# EAGLE design thg (EAGLE 9.3.0)
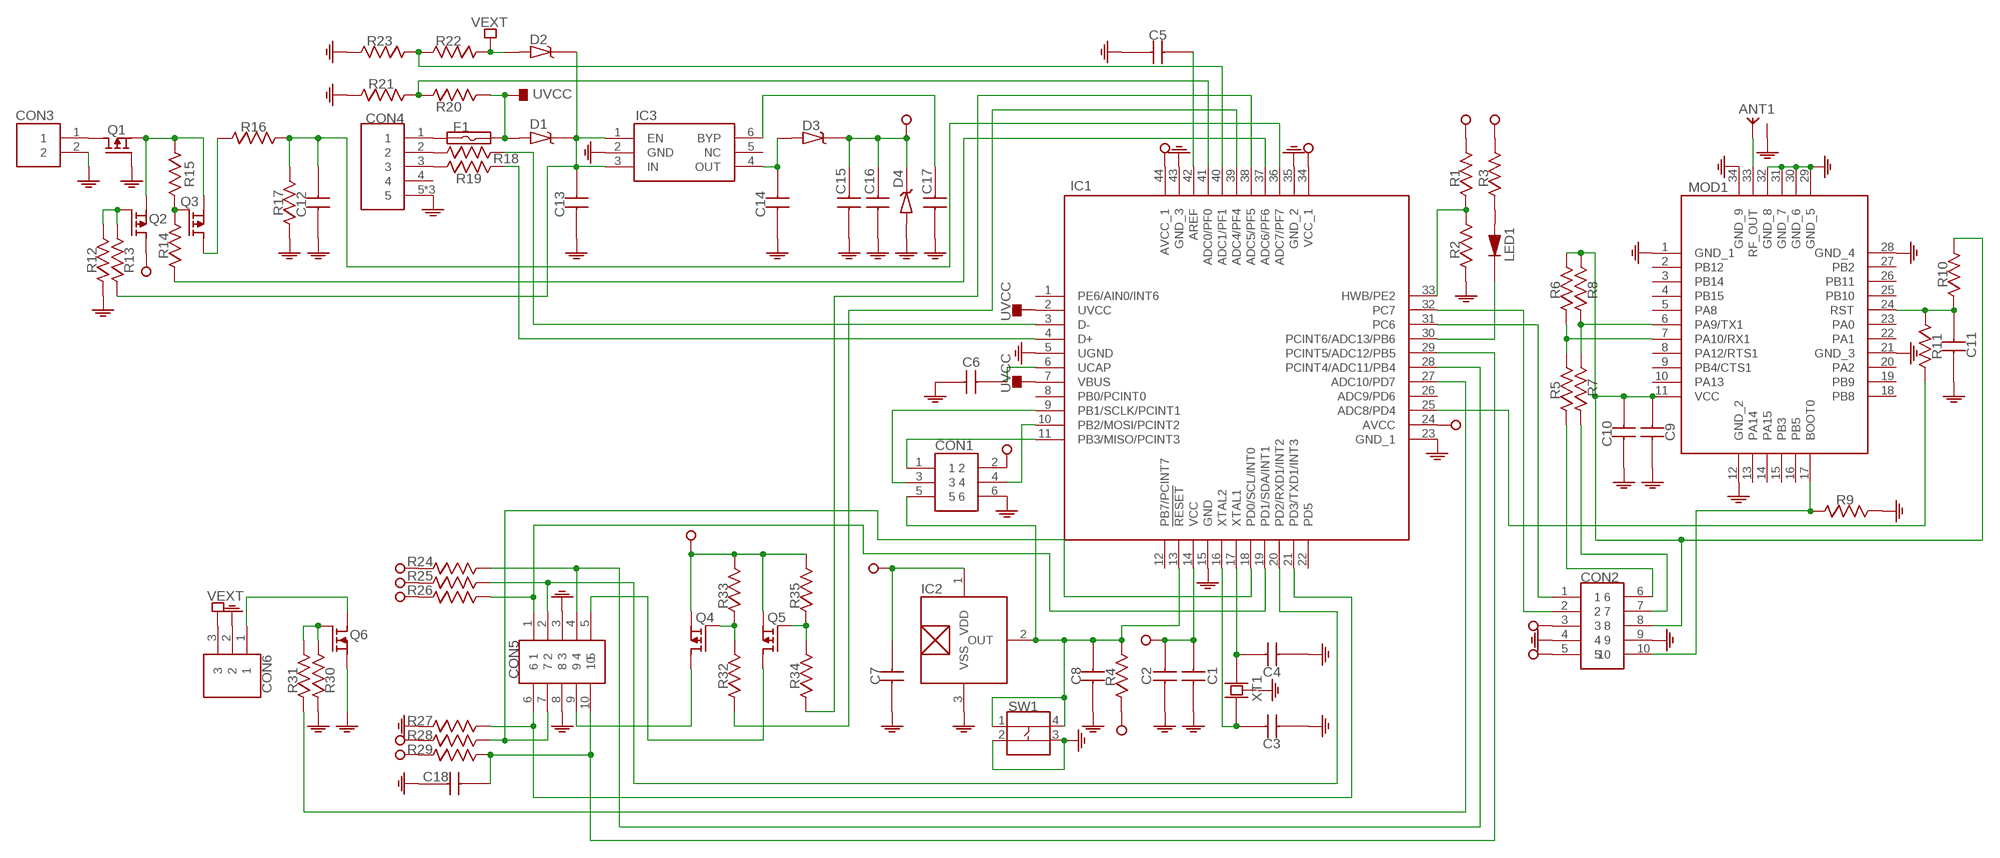
[diagram p0: schematic, sheet 1]

## Parts
ANT1  SMA-RF  [SMA-RF]
C1  CAPACITOR-0603  [0603]
C2  CAPACITOR-0603  [0603]
C3  CAPACITOR-0603  [0603]
C4  CAPACITOR-0603  [0603]
C5  CAPACITOR-0603  [0603]
C6  CAPACITOR-0603  [0603]
C7  CAPACITOR-0603  [0603]
C8  CAPACITOR-0603  [0603]
C9  CAPACITOR-0603  [0603]
C10  CAPACITOR-0603  [0603]
C11  CAPACITOR-0603  [0603]
C12  CAPACITOR-0603  [0603]
C13  CAPACITOR-0805  [0805]
C14  CAPACITOR-0805  [0805]
C15  CAPACITOR-0603  [0603]
C16  CAPACITOR-0603  [0603]
C17  CAPACITOR-0603  [0603]
C18  CAPACITOR-0603  [0603]
CON1  ISP  [ISP]
CON2  HEADER-10P-2R-DIP-2_54MM  [HEADER-10P-2R-DIP-2_54MM]
CON3  JST-PH-2-2.0MM  [JST-PH-2-2.0MM]
CON4  USB-MICRO-DIP-VER  [USB-MICRO-DIP-VER]
CON5  HEADER-10P-2R-DIP-2_54MM  [HEADER-10P-2R-DIP-2_54MM]
CON6  CON-3_50MM-3P-1985205  [CON-3_50MM-3P-1985205]
D1  DIODE-SCHOTTKY  [SOD123-DIODE]
D2  DIODE-SCHOTTKY  [SOD123-DIODE]
D3  DIODE-SCHOTTKY  [SOD123-DIODE]
D4  ZENER-SOD123  [SOD123-DIODE]
F1  FUSE-0805  [0805]
IC1  ATMEGA32U4-MU  [QFN-44]
IC2  S-5712-SOT23-3  [SOT23-3]
IC3  MIC5219-VDFN-6  [VDFN-6]
LED1  LED-0603  [LED-0603]
MOD1  RAK811  [RAK811]
Q1  P-MOSFET  [SOT23-3]
Q2  P-MOSFET  [SOT23-3]
Q3  P-MOSFET  [SOT23-3]
Q4  P-MOSFET  [SOT23-3]
Q5  P-MOSFET  [SOT23-3]
Q6  N-MOSFET  [SOT23-3]
R1  RESISTOR-0603  [0603]
R2  RESISTOR-0603  [0603]
R3  RESISTOR-0603  [0603]
R4  RESISTOR-0603  [0603]
R5  RESISTOR-0603  [0603]
R6  RESISTOR-0603  [0603]
R7  RESISTOR-0603  [0603]
R8  RESISTOR-0603  [0603]
R9  RESISTOR-0603  [0603]
R10  RESISTOR-0603  [0603]
R11  RESISTOR-0603  [0603]
R12  RESISTOR-0603  [0603]
R13  RESISTOR-0603  [0603]
R14  RESISTOR-0603  [0603]
R15  RESISTOR-0603  [0603]
R16  RESISTOR-0603  [0603]
R17  RESISTOR-0603  [0603]
R18  RESISTOR-0603  [0603]
R19  RESISTOR-0603  [0603]
R20  RESISTOR-0603  [0603]
R21  RESISTOR-0603  [0603]
R22  RESISTOR-0603  [0603]
R23  RESISTOR-0603  [0603]
R24  RESISTOR-0603  [0603]
R25  RESISTOR-0603  [0603]
R26  RESISTOR-0603  [0603]
R27  RESISTOR-0603  [0603]
R28  RESISTOR-0603  [0603]
R29  RESISTOR-0603  [0603]
R30  RESISTOR-0603  [0603]
R31  RESISTOR-0603  [0603]
R32  RESISTOR-0603  [0603]
R33  RESISTOR-0603  [0603]
R34  RESISTOR-0603  [0603]
R35  RESISTOR-0603  [0603]
SW1  BUTTON-4P-SMD-5X5  [BUTTON-4P-SMD-5X5]
XT1  CRYSTAL-5032-4P  [CRYSTAL-5032-4P]

## Nets
GND: ANT1.2(GND) ANT1.3(GND) ANT1.4(GND) ANT1.5(GND) C1.1 C2.1 C3.1 C4.1 C5.1 C6.1 C7.1 C8.1 C9.1 C10.1 C11.1 C12.1 C13.1 C14.1 C15.1 C16.1 C17.1 C18.1 CON1.6 CON2.4 CON2.9 CON3.2 CON4.5 CON4.6 CON4.7 CON5.3 CON5.8 CON6.2 D4.2(A) IC1.5(UGND) IC1.15(GND) IC1.23(GND_1) IC1.35(GND_2) IC1.43(GND_3) IC2.3(VSS) IC3.2(GND) MOD1.1(GND_1) MOD1.12(GND_2) MOD1.21(GND_3) MOD1.28(GND_4) MOD1.29(GND_5) MOD1.30(GND_6) MOD1.31(GND_7) MOD1.32(GND_8) MOD1.34(GND_9) Q1.1(G) Q6.2(S) R2.1 R9.2 R12.1 R17.1 R21.1 R23.2 R27.1 R30.1 SW1.2 SW1.3
N$1: CON5.1 IC1.19(PD1/SDA/INT1) R26.2
N$2: C11.2 MOD1.24(RST) R10.1 R11.1
N$3: CON1.1 IC1.11(PB3/MISO/PCINT3)
N$4: ANT1.1(ANT) MOD1.33(RF_OUT)
N$5: CON5.9 Q4.3(D)
N$6: MOD1.7(PA10/RX1) R5.2 R6.1
N$7: MOD1.6(PA9/TX1) R7.2 R8.1
N$8: IC1.27(ADC10/PD7) R31.1
N$9: CON1.4 IC1.10(PB2/MOSI/PCINT2)
N$10: C3.2 IC1.16(XTAL2) XT1.1
N$11: CON5.5 Q5.3(D)
N$12: C4.2 IC1.17(XTAL1) XT1.3
N$13: C9.2 C10.2 CON2.8 MOD1.11(VCC) R6.2 R8.2 R10.2
N$14: CON2.7 R7.1
N$15: Q6.1(G) R30.2 R31.2
N$16: IC1.25(ADC8/PD4) R11.2
N$17: CON5.4 IC1.28(PCINT4/ADC11/PB4) R24.2
N$18: CON6.1 Q6.3(D)
N$19: IC1.30(PCINT6/ADC13/PB6) LED1.1(K)
N$20: C18.2 CON5.10 IC1.29(PCINT5/ADC12/PB5) R29.2
N$21: CON2.1 IC1.31(PC6)
N$22: CON5.7 IC1.18(PD0/SCL/INT0) R28.2
N$23: CON2.2 IC1.32(PC7)
N$24: CON5.2 IC1.20(PD2/RXD1/INT2) R25.2
N$25: CON5.6 IC1.21(PD3/TXD1/INT3) R27.2
N$28: Q5.1(G) R34.2 R35.1
N$31: C5.2 IC1.42(AREF)
N$32: Q3.1(G) R14.2 R15.2
N$33: CON4.1 F1.1
N$34: C6.2 IC1.6(UCAP)
N$35: LED1.2(A) R3.1
N$36: C12.2 IC1.36(ADC7/PF7) R16.2 R17.2
N$37: C17.2 IC3.6(BYP)
N$38: C13.2 D1.1(K) D2.1(K) IC3.1(EN) IC3.3(IN) R13.1
N$39: IC1.41(ADC0/PF0) R20.1 R21.2
N$40: C14.2 D3.2(A) IC3.4(OUT)
N$41: CON4.2 R18.1
N$42: CON4.3 R19.1
N$43: IC1.3(D-) R18.2
N$44: IC1.4(D+) R19.2
N$45: CON1.3 IC1.9(PB1/SCLK/PCINT1)
N$46: Q4.1(G) R32.2 R33.1
N$47: IC1.37(ADC6/PF6) R14.1
N$49: IC1.40(ADC1/PF1) R22.2 R23.1
N$50: IC1.38(ADC5/PF5) R34.1
N$51: IC1.39(ADC4/PF4) R32.1
N$53: Q2.1(G) R12.2 R13.2
N$55: CON3.1 Q1.3(D)
N$58: Q1.2(S) Q2.2(S) Q3.2(S) R15.1
N$59: Q3.3(D) R16.1
N$60: CON2.6 R5.1
N$61: IC1.33(HWB/PE2) R1.1 R2.2
N$63: CON2.10 MOD1.17(BOOT0) R9.1
N$64: C8.2 CON1.5 IC1.13(!RESET) IC2.2(OUT) R4.2 SW1.1 SW1.4
UVCC: D1.2(A) F1.2 IC1.2(UVCC) IC1.7(VBUS) R20.2
VCC: C1.2 C2.2 C7.2 C15.2 C16.2 CON1.2 CON2.3 CON2.5 D3.1(K) D4.1(K) IC1.14(VCC) IC1.24(AVCC) IC1.34(VCC_1) IC1.44(AVCC_1) IC2.1(VDD) Q2.3(D) Q4.2(S) Q5.2(S) R1.2 R3.2 R4.1 R24.1 R25.1 R26.1 R28.1 R29.1 R33.2 R35.2
VEXT: CON6.3 D2.2(A) R22.1
Unconnected: CON4.4 IC1.1(PE6/AIN0/INT6) IC1.8(PB0/PCINT0) IC1.12(PB7/PCINT7) IC1.22(PD5) IC1.26(ADC9/PD6) IC3.5(NC) MOD1.2(PB12) MOD1.3(PB14) MOD1.4(PB15) MOD1.5(PA8) MOD1.8(PA12/RTS1) MOD1.9(PB4/CTS1) MOD1.10(PA13) MOD1.13(PA14) MOD1.14(PA15) MOD1.15(PB3) MOD1.16(PB5) MOD1.18(PB8) MOD1.19(PB9) MOD1.20(PA2) MOD1.22(PA1) MOD1.23(PA0) MOD1.25(PB10) MOD1.26(PB11) MOD1.27(PB2)

## Power pins joined to a net without a drawn wire
GND: XT1.2(GND) XT1.4(GND)

## Library data of the parts
ANT1 = SamacSys_Parts:SMA-RF
C1-C12 C15-C18 = SamacSys_Parts:CAPACITOR-0603
C13 C14 = SamacSys_Parts:CAPACITOR-0805
CON1 = SamacSys_Parts:ISP
CON2 CON5 = SamacSys_Parts:HEADER-10P-2R-DIP-2_54MM
CON3 = SamacSys_Parts:JST-PH-2-2.0MM
CON4 = SamacSys_Parts:USB-MICRO-DIP-VER
CON6 = SamacSys_Parts:CON-3_50MM-3P-1985205
D1-D3 = SamacSys_Parts:DIODE-SCHOTTKY
D4 = SamacSys_Parts:ZENER-SOD123
F1 = SamacSys_Parts:FUSE-0805
IC1 = SamacSys_Parts:ATMEGA32U4-MU
IC2 = SamacSys_Parts:S-5712-SOT23-3
IC3 = SamacSys_Parts:MIC5219-VDFN-6
LED1 = SamacSys_Parts:LED-0603
MOD1 = SamacSys_Parts:RAK811
Q1-Q5 = SamacSys_Parts:P-MOSFET
Q6 = SamacSys_Parts:N-MOSFET
R1-R35 = SamacSys_Parts:RESISTOR-0603
SW1 = SamacSys_Parts:BUTTON-4P-SMD-5X5
XT1 = SamacSys_Parts:CRYSTAL-5032-4P

## Board
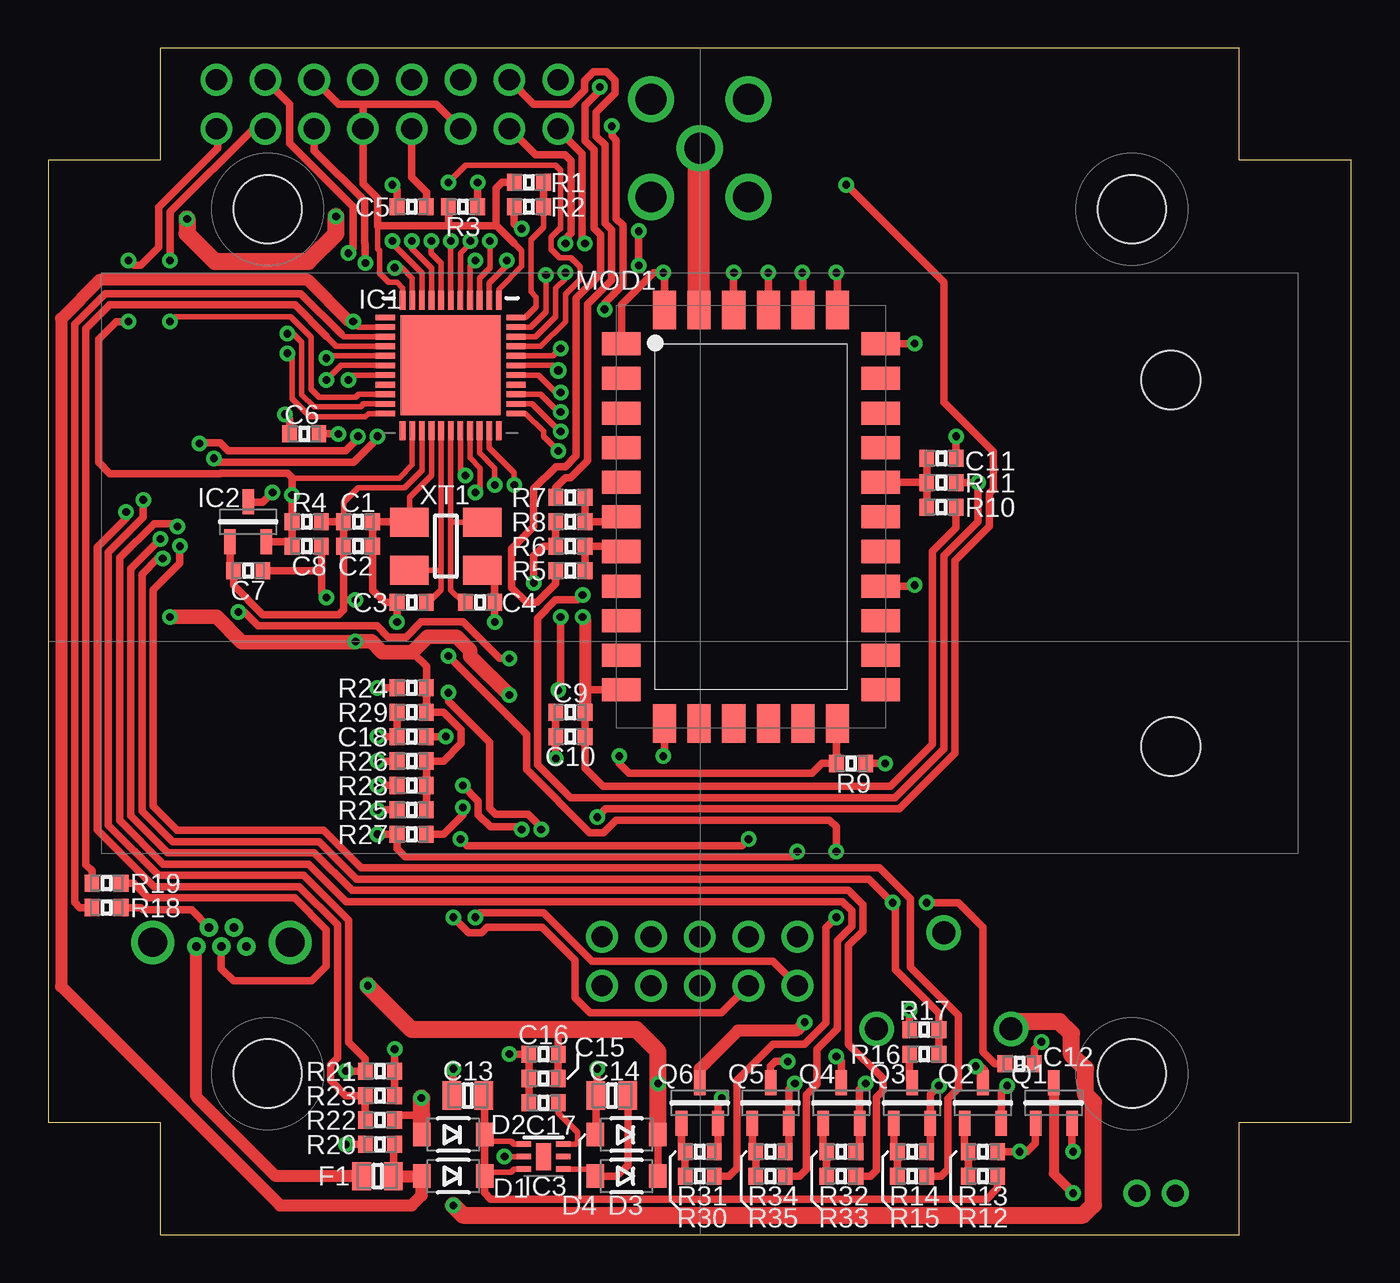
[diagram p1: board, top side]
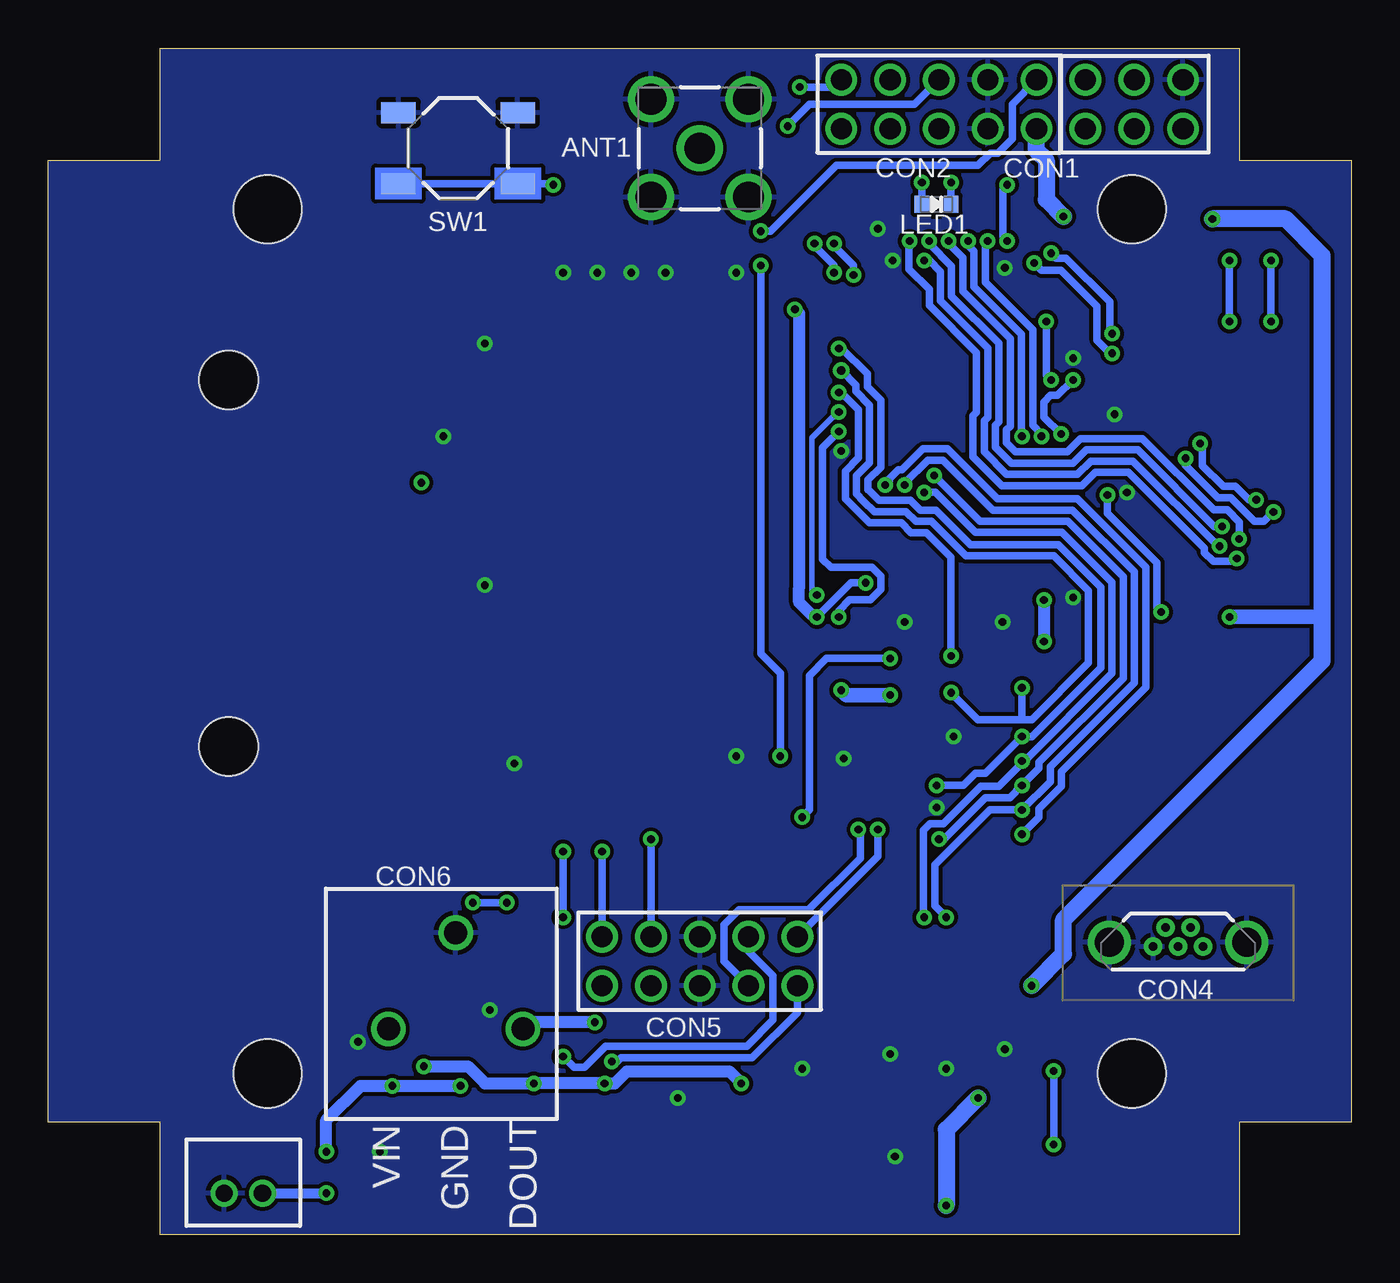
[diagram p2: board, bottom side, seen from below]

Size 67.82 x 61.72 mm. Coordinates in mm from the lower left corner, seen from the top.
Outline: 0,5.84 5.84,5.84 5.84,0 61.98,0 61.98,5.84 67.82,5.84 67.82,55.88 61.98,55.88 61.98,61.72 5.84,61.72 5.84,55.88 0,55.88 0,5.84
Copper layers (1*16): Top 0.035mm / dielectric 1.5mm / Bottom 0.035mm
Design rules "qfn": minimum track width 10mil, minimum drill 0.4mm, track to track 8mil, track to pad 10mil, pad to pad 8mil, via to via 8mil, smd to smd 0mil, copper to edge 0mil, drill to drill 6mil, minimum pad ring 10mil, minimum via ring 8mil, stop-mask expansion 4mil, vias tented up to drill 25mil, thermal gap 10mil
Holes 3.56 mm at 11.43,8.38 56.39,8.38 56.39,53.34 11.43,53.34
Holes 3.05 mm at 58.42,44.45 58.42,25.4
bRestrict: area 21.3,52.8 to 21.8,55

### Footprints (pad centres in the part's own frame; a part is rotated, then mirrored left to right if it is on the bottom)
SMA-RF = drill 1.6: 1 0,0; 2 -2.54,2.54; 3 -2.54,-2.54; 4 2.54,-2.54; 5 2.54,2.54
0603 = smd 0.762 x 0.889: 1 -0.762,0; 2 0.762,0
0805 = smd 0.97 x 1.47: 1 -0.83,0; 2 0.83,0
ISP = drill 1.1 pad 1.65: 1 0,0; 2 2.54,0; 3 0,-2.54; 4 2.54,-2.54; 5 0,-5.08; 6 2.54,-5.08
HEADER-10P-2R-DIP-2_54MM = drill 1.1 pad 1.65: 1 0,0; 2 2.54,0; 3 5.08,0; 4 7.62,0; 5 10.16,0; 6 0,2.54; 7 2.54,2.54; 8 5.08,2.54; 9 7.62,2.54; 10 10.16,2.54
JST-PH-2-2.0MM = drill 0.9: 1 -1,0; 2 1,0
USB-MICRO-DIP-VER = drill 0.45: 1 -1.3,0; 2 -0.65,-1; 3 0,0; 4 0.65,-1; 5 1.3,0 | drill 1.5: 6 -3.575,-0.22; 7 3.575,-0.22
CON-3_50MM-3P-1985205 = drill 1.2: 1 3.5,-2.5; 2 0,2.5; 3 -3.5,-2.5
SOD123-DIODE = smd 0.91 x 1.22: 1 -1.635,0; 2 1.635,0
QFN-44 = smd 1 x 0.3: 1 -3.4,2.5; 2 -3.4,2; 3 -3.4,1.5; 4 -3.4,1; 5 -3.4,0.5; 6 -3.4,0; 7 -3.4,-0.5; 8 -3.4,-1; 9 -3.4,-1.5; 10 -3.4,-2; 11 -3.4,-2.5; 23 3.4,-2.5; 24 3.4,-2; 25 3.4,-1.5; 26 3.4,-1; 27 3.4,-0.5; 28 3.4,0; 29 3.4,0.5; 30 3.4,1; 31 3.4,1.5; 32 3.4,2; 33 3.4,2.5 | smd 0.3 x 1: 12 -2.5,-3.4; 13 -2,-3.4; 14 -1.5,-3.4; 15 -1,-3.4; 16 -0.5,-3.4; 17 0,-3.4; 18 0.5,-3.4; 19 1,-3.4; 20 1.5,-3.4; 21 2,-3.4; 22 2.5,-3.4; 34 2.5,3.4; 35 2,3.4; 36 1.5,3.4; 37 1,3.4; 38 0.5,3.4; 39 0,3.4; 40 -0.5,3.4; 41 -1,3.4; 42 -1.5,3.4; 43 -2,3.4; 44 -2.5,3.4 | smd 5.2 x 5.2: 45 0,0
SOT23-3 = smd 1.3 x 0.6: 1 -1.05,0.95; 2 -1.05,-0.95; 3 1.05,0
VDFN-6 = smd 0.75 x 0.3: 1 -1.025,0.65; 2 -1.025,0; 3 -1.025,-0.65; 4 1.025,-0.65; 5 1.025,0; 6 1.025,0.65 | smd 0.8 x 1.4: 7 0,0
LED-0603 = smd 0.762 x 0.889: 1 -0.762,0; 2 0.762,0
RAK811 = smd 2 x 1.2: 1 -6.75,9; 2 -6.75,7.2; 3 -6.75,5.4; 4 -6.75,3.6; 5 -6.75,1.8; 6 -6.75,0; 7 -6.75,-1.8; 8 -6.75,-3.6; 9 -6.75,-5.4; 10 -6.75,-7.2; 11 -6.75,-9; 18 6.75,-9; 19 6.75,-7.2; 20 6.75,-5.4; 21 6.75,-3.6; 22 6.75,-1.8; 23 6.75,0; 24 6.75,1.8; 25 6.75,3.6; 26 6.75,5.4; 27 6.75,7.2; 28 6.75,9 | smd 1.2 x 2: 12 -4.5,-10.75; 13 -2.7,-10.75; 14 -0.9,-10.75; 15 0.9,-10.75; 16 2.7,-10.75; 17 4.5,-10.75; 29 4.5,10.75; 30 2.7,10.75; 31 0.9,10.75; 32 -0.9,10.75; 33 -2.7,10.75; 34 -4.5,10.75
BUTTON-4P-SMD-5X5 = smd 1.8 x 1.1: 1 -3.1,1.85; 2 -3.1,-1.85; 3 3.1,-1.85; 4 3.1,1.85
CRYSTAL-5032-4P = smd 2 x 1.5: 1 -1.9,-1.25; 2 1.9,-1.25; 3 1.9,1.25; 4 -1.9,1.25

### Placement (x,y rotation side)
ANT1  33.91,56.52 0 bottom
C1  16.13,37.08 180 top
C2  16.13,35.81 180 top
C3  18.92,32.89 0 top
C4  22.48,32.89 180 top
C5  18.92,53.47 180 top
C6  13.34,41.66 0 top
C7  10.41,34.54 180 top
C8  13.46,35.81 180 top
C9  27.18,27.18 0 top
C10  27.18,25.91 0 top
C11  46.48,40.39 180 top
C12  50.55,8.89 180 top
C13  21.84,7.24 0 top
C14  29.34,7.24 0 top
C15  25.78,8.13 0 top
C16  25.78,9.4 0 top
C17  25.78,6.86 0 top
C18  18.92,25.91 180 top
CON1  13.84,57.53 90 bottom
CON2  26.54,57.53 0 bottom
CON3  57.66,2.16 180 bottom
CON4  9.02,14.99 180 bottom
CON5  38.99,12.95 0 bottom
CON6  46.61,13.21 0 bottom
D1  21.08,3.05 180 top
D2  21.08,5.21 180 top
D3  30.1,3.05 180 top
D4  30.1,5.21 180 top
F1  17.14,3.05 0 top
IC1  20.95,45.21 0 top
IC2  10.41,37.08 90 top
IC3  25.78,4.06 0 top
LED1  21.59,53.59 180 bottom
MOD1  36.58,37.34 0 top
Q1  52.32,6.86 90 top
Q2  48.64,6.86 90 top
Q3  44.96,6.86 90 top
Q4  41.27,6.86 90 top
Q5  37.59,6.86 90 top
Q6  33.91,6.86 90 top
R1  25.02,54.74 180 top
R2  25.02,53.47 0 top
R3  21.59,53.47 180 top
R4  13.46,37.08 180 top
R5  27.18,34.54 0 top
R6  27.18,35.81 180 top
R7  27.18,38.35 0 top
R8  27.18,37.08 180 top
R9  41.78,24.51 0 top
R10  46.48,37.85 0 top
R11  46.48,39.12 0 top
R12  48.64,4.32 180 top
R13  48.64,3.05 180 top
R14  44.96,3.05 180 top
R15  44.96,4.32 180 top
R16  45.59,9.4 0 top
R17  45.59,10.67 0 top
R18  3.05,17.02 180 top
R19  3.05,18.29 180 top
R20  17.27,4.7 0 top
R21  17.27,8.51 180 top
R22  17.27,5.97 180 top
R23  17.27,7.24 0 top
R24  18.92,28.45 180 top
R25  18.92,22.1 180 top
R26  18.92,24.64 180 top
R27  18.92,20.83 180 top
R28  18.92,23.37 180 top
R29  18.92,27.18 180 top
R30  33.91,4.32 180 top
R31  33.91,3.05 180 top
R32  41.27,3.05 180 top
R33  41.27,4.32 0 top
R34  37.59,3.05 180 top
R35  37.59,4.32 0 top
SW1  46.48,56.52 180 bottom
XT1  20.7,35.81 0 top

### Tracks (layer width: path | path; a pad name or v marks a point on that pad's centre or on a via)
GND  (via drill 0.4)
  Top 0.292: IC3.2 v23.75,4.06 | IC1.15 19.95,39.51 18.8,38.36 XT1.4 18.8,37.08 | IC1.5 14.6,45.71 v14.48,45.59 | IC1.35 22.95,49.5 23.88,50.42 v23.88,50.67 | IC1.23 24.85,42.71 25.78,41.78 25.78,41.53 v26.54,40.77 | IC1.43 18.95,49.75 18.41,50.29 v18.03,50.29
  Top 0.381: R23.2 R21.1 v18.03,9.65 | D4.2 28.51,5.25 C14.1 28.57,7.31 v28.57,8.64 | C17.1 C15.1 C16.1 v24,9.4 | C13.1 21.08,7.31 v21.08,8.64 | R12.1 v50.55,4.32 50.93,4.32 51.37,4.76 Q1.1 | XT1.2 23.1,35.06 23.24,34.92 C4.1 v23.24,31.88 | 18.8,37.08 C1.1 C2.1 16.89,33.53 17.53,32.89 C3.1 v18.16,31.88 | C8.1 14.22,34.54 | 14.22,34.54 14.22,33.4 v14.48,33.15 | MOD1.34 32.08,49.97 v32,50.04 31.5,50.04 29.83,48.37 MOD1.1 | MOD1.32 35.68,50.03 v35.69,50.04 | MOD1.31 37.48,50.03 v37.47,50.04 | MOD1.30 39.28,50.01 v39.24,50.04 | MOD1.29 41.08,49.98 v41.02,50.04 | MOD1.28 45.07,46.34 v45.09,46.35 | MOD1.21 45.04,33.74 v45.09,33.78 | MOD1.12 32.08,24.96 v32,24.89 | v11.68,38.61 11.18,38.1 10.45,38.1 IC2.3 | C11.1 v47.24,41.53 | C9.1 C10.1 v26.42,24.77 | R9.2 v43.56,24.51 | C5.1 19.68,54.23 18.92,54.99 CON2.4 | R2.1 24.26,52.58 24.51,52.32 v24.64,52.32 | v51.69,10.03 51.31,9.65 C12.1 | v44.83,11.68 R17.1 | R30.1 34.86,4.51 Q6.2 34.86,6.92 v35.05,7.11 | C6.1 12.57,42.42 v12.32,42.67 | C7.1 14.22,34.54 | C18.1 v20.7,25.91 | v21.59,22.23 21.59,21.84 20.57,20.83 R27.1
  pour Bottom: 0.13,5.97 0.13,55.75 5.97,55.75 5.97,61.59 61.85,61.59 61.85,55.75 67.69,55.75 67.69,5.97 61.85,5.97 61.85,0.13 5.97,0.13 5.97,5.97
N$1  (via drill 0.4)
  Top 0.292: v22.23,38.61 22.48,38.86 22.48,39.88 21.95,40.4 IC1.19
  Top 0.381: CON5.1 37.72,14.22 28.3,14.22 25.79,16.74 22.45,16.74 v22.23,16.51 | R26.2 v17.14,24.64
  Bottom 0.381: v22.23,38.61 21.65,38.61 19.57,36.52 15.06,36.52 12.46,33.93 12.46,29.19 17.02,24.64 v17.14,24.64 17.14,24.51 18.34,23.32 19.29,23.32 21.24,21.37 21.92,21.37 22.26,21.03 22.26,16.55 v22.23,16.51
N$2
  Top 0.381: C11.2 R11.1 | R11.1 R10.1 | MOD1.24 45.7,39.14 R11.1
N$3  (via drill 0.4)
  Top 0.292: IC1.11 16.68,42.71 16.51,42.55 13.59,42.55 13.59,42.61 12.7,43.49 12.7,45.59 v12.45,45.85
  Top 0.381: CON1.1 13.84,56.39 16.46,53.77 16.46,51.6 16.51,51.55 v16.51,50.55
  Bottom 0.381: v12.45,45.85 12.57,45.85 13.24,46.52 13.24,48.3 15.11,50.16 16.13,50.16 v16.51,50.55
N$4
  Top 1.143: MOD1.33 33.88,56.48 ANT1.1
N$5  (via drill 0.4)
  Top 0.381: v41.02,9.27 41.27,9.02 Q4.3
  Bottom 0.381: v41.02,9.27 40.46,8.71 39.91,8.71 38.81,9.81 31.46,9.81 30.1,11.18 30.1,13.48 31.37,14.75 CON5.9
N$6
  Top 0.381: MOD1.7 29.55,35.81 R6.1 R5.2
N$7
  Top 0.381: MOD1.6 29.57,37.08 R8.1 R7.2
N$8  (via drill 0.4)
  Top 0.292: IC1.27 25.52,44.71 26.42,43.81 v26.67,43.81
  Top 0.381: R31.1 35.43,3.05 35.85,3.46 35.85,8.04 37.72,9.91 39.37,9.91 40.49,11.02 40.49,15.98 v41.02,16.51 | v20.83,30.1 24.89,26.04 24.89,24.21 28.18,20.92 28.91,20.92 29.55,21.57 40.66,21.57 41.02,21.21 v41.02,19.94
  Bottom 0.381: v41.02,16.51 v41.02,19.94 | v20.83,30.1 20.83,35.24 22.1,36.52 22.91,36.52 23.42,37.02 25.08,37.02 26.34,38.29 26.34,39.72 25.65,40.4 25.65,42.91 26.56,43.81 v26.67,43.81
N$9  (via drill 0.4)
  Top 0.292: v12.45,46.86 12.75,46.86 13.2,46.41 13.2,43.7 13.84,43.05 16.26,43.05 16.41,43.21 IC1.10
  Top 0.381: v15.62,51.05 15.88,51.31 15.88,53.47 12.57,56.77 12.57,58.8 CON1.4
  Bottom 0.381: v12.45,46.86 12.57,46.99 12.57,48.52 14.86,50.8 15.37,50.8 v15.62,51.05
N$10
  Top 0.292: IC1.16 20.45,34.56 | 20.45,34.56 20.45,33.54 19.81,32.89 C3.2 | XT1.1 20.45,34.56
N$11  (via drill 0.4)
  Top 0.381: Q5.3 37.59,8.76 37.85,9.02 v38.48,9.02
  Bottom 0.381: v38.48,9.02 38.18,9.02 37.99,9.2 31.18,9.2 28.83,11.56 CON5.5
N$12
  Top 0.292: C4.2 21.59,32.89 20.95,33.53 20.95,37.08 | IC1.17 20.95,37.08 | XT1.3 20.98,37.06 20.95,37.08
N$13  (via drill 0.4)
  Top 0.381: C9.2 C10.2 27.94,24.26 28.86,23.33 43.84,23.33 46.02,25.52 46.02,35.55 47.24,36.77 R10.2 | R8.2 R6.2 25.78,35.81 25.27,35.31 v25.27,33.91 | v28.96,48.13 28.96,48.45 29.91,49.4 29.91,52.5 29.57,52.84 29.57,56.92 29.34,57.15 v29.34,57.66 | MOD1.11 28.05,28.34 27.94,28.45
  Top 0.635: v27.81,32.13 27.94,32 27.94,28.45 C9.2
  Bottom 0.381: v27.81,32.13 27.81,32.15 26.05,33.91 v25.27,33.91 | v29.34,57.66 28.19,58.8 22.73,58.8 CON2.8
  Bottom 0.635: v27.81,32.13 27.91,32.22 28.07,32.22 28.74,32.89 28.74,33.66 28.73,33.67 28.73,47.9 v28.96,48.13
N$14
  Top 0.381: CON2.7 25.27,58.8 27.18,58.8 27.91,59.53 27.91,60.02 28.37,60.49 29.05,60.49 29.5,60.04 29.5,59.36 28.52,58.38 28.52,57.14 28.98,56.68 28.98,52.6 29.32,52.26 29.32,49.64 28.07,48.39 28.07,40.26 27.18,39.37 26.92,39.37 26.42,38.86 R7.1
N$15
  Top 0.381: Q6.1 32.96,4.51 R30.2 R31.2
N$16  (via drill 0.4)
  Top 0.292: IC1.25 25.63,43.71 26.54,42.8 v26.67,42.8
  Top 0.381: R11.2 v48.39,39.12 48.39,37.08 46.61,35.31 46.61,25.27 44.07,22.73 27.19,22.73 25.47,24.46 25.47,32.08 26.42,33.02 27.56,33.02 v27.81,33.27
  Bottom 0.292: v27.81,33.27 28.06,33.52 28.06,41.46 26.98,42.53 26.93,42.53 v26.67,42.8
N$17  (via drill 0.4, 0.45)
  Top 0.292: v26.54,44.96 26.29,45.21 IC1.28
  Top 0.381: R24.2 v17.14,28.45 | v20.83,28.19 20.83,27.75 22.97,25.61 22.97,22.19 23.28,21.88 24.97,21.88 25.65,21.19 v25.65,21.08
  Bottom 0.381: CON5.4 32.64,14.22 32.64,16.13 31.88,16.89 28.26,16.89 25.56,19.59 25.56,20.99 v25.65,21.08 | v20.83,28.19 19.43,26.8 17.14,26.8 | 17.14,26.8 16.64,26.8 13.68,29.75 13.68,33.49 15.49,35.31 20.07,35.31 21.86,37.1 22.67,37.1 23.18,37.61 24.83,37.61 25.38,38.16 25.39,38.16 25.76,38.53 25.76,39.47 25.07,40.16 25.07,43.15 25.78,43.86 25.78,44.2 v26.54,44.96 | v17.14,28.45 17.14,26.8
N$18  (via drill 0.4)
  Top 0.635: Q6.3 33.91,8.64 35.89,10.62 38.94,10.62 v39.37,11.05
  Bottom 0.635: v39.37,11.05 42.77,11.05 CON6.1
N$19  (via drill 0.4)
  Top 0.292: IC1.30 25.64,46.21 26.92,47.5 26.92,48.91 27.68,49.66 27.68,50.35 27.22,50.81 26.61,50.81 26.17,51.25 26.17,51.87 26.61,52.31 26.66,52.31 26.67,52.32 26.67,55.37 26.42,55.63 21.72,55.63 v20.83,54.74
  Bottom 0.381: LED1.1 v20.83,54.74
N$20  (via drill 0.4)
  Top 0.292: IC1.29 26.28,45.71 v26.67,46.1
  Top 0.381: R29.2 C18.2 v17.14,25.91 | v21.59,23.37 21.59,23.35 22.39,22.55 22.39,21.84 23.02,21.21 24.51,21.21 v24.64,21.08
  Bottom 0.381: CON5.10 24.64,19.68 v24.64,21.08 | v21.59,23.37 20.19,23.37 19.56,24 19.05,24 v17.14,25.91 16.64,25.91 13.05,29.5 13.05,33.68 15.25,35.89 19.82,35.89 21.62,37.68 22.43,37.68 22.94,38.19 24.59,38.19 25.14,38.74 25.15,38.74 25.15,39.26 24.49,39.92 24.49,43.39 25.2,44.1 25.2,44.77 26.52,46.1 v26.67,46.1
N$21  (via drill 0.4)
  Top 0.292: IC1.31 25.38,46.71 26.42,47.75 26.42,49.23 26.92,49.74 v26.92,50.04
  Top 0.381: v27.94,51.56 27.79,51.71 27.79,56.22 26.54,57.47 CON2.1
  Bottom 0.381: v26.92,50.04 26.92,50.42 27.94,51.44 v27.94,51.56
N$22  (via drill 0.4)
  Top 0.292: IC1.18 21.45,39.76 v21.72,39.5
  Top 0.381: v21.46,20.57 21.79,20.24 36.12,20.24 v36.45,20.57 | R28.2 v17.14,23.37
  Bottom 0.381: v21.72,39.5 19.33,37.11 14.76,37.11 11.88,34.23 11.88,28.95 16.26,24.57 16.26,24.26 v17.14,23.37 17.78,22.73 19.05,22.73 21.21,20.57 v21.46,20.57 | CON5.7 v36.45,20.57
N$23  (via drill 0.4)
  Top 0.292: IC1.32 25.11,47.21 25.91,48.01 v25.91,49.91
  Top 0.381: v26.92,51.56 27.05,51.69 27.05,51.94 27.21,52.1 27.21,55.85 26.89,56.17 25.37,56.17 CON2.2
  Bottom 0.381: v25.91,49.91 25.91,50.42 26.92,51.44 v26.92,51.56
N$24  (via drill 0.4)
  Top 0.292: v23.24,38.99 23.24,39.88 22.45,40.66 IC1.20
  Top 0.381: CON5.2 35.05,11.56 28.19,11.56 27.43,12.32 27.43,14.27 25.7,16 22.84,16 22.55,15.71 21.88,15.71 v21.08,16.51 | R25.2 v17.14,22.1
  Bottom 0.381: v23.24,38.99 23.24,39.1 22.05,40.29 21.26,40.29 18.66,37.69 14.51,37.69 11.29,34.47 11.29,28.71 15.67,24.33 15.67,23.57 v17.14,22.1 18.81,22.1 21.68,19.23 21.68,17.1 v21.08,16.51
N$25  (via drill 0.4)
  Top 0.292: IC1.21 22.95,40.93 24.26,39.62 v24.26,38.99
  Top 0.381: v38.99,19.94 38.71,19.66 18.57,19.66 18.16,20.07 R27.2 v17.14,20.83
  Bottom 0.381: v24.26,38.99 24.04,39.21 24.04,39.32 23.57,39.79 23.38,39.79 22.29,40.88 21.02,40.88 18.42,38.28 14.27,38.28 10.71,34.72 10.71,28.47 15.09,24.09 15.09,23.33 16.26,22.16 16.26,21.72 v17.14,20.83 | CON5.6 v38.99,19.94
N$28
  Top 0.381: Q5.1 36.64,4.51 R35.1 R34.2
N$31  (via drill 0.4)
  Top 0.292: IC1.42 19.45,50.01 17.91,51.56 v17.91,51.69
  Top 0.381: v17.91,54.61 18.16,54.36 C5.2
  Bottom 0.381: v17.91,51.69 18.13,51.91 18.13,54.39 v17.91,54.61
N$32
  Top 0.381: R14.2 R15.2 44.01,4.51 Q3.1
N$33
  Top 0.635: F1.1 11.85,3.05 7.72,7.18 CON4.1
N$34  (via drill 0.4)
  Top 0.292: IC1.6 15.24,45.21 v14.48,44.45
  Top 0.381: v15.11,41.66 C6.2
  Bottom 0.381: v15.11,41.66 15.13,41.66 16,42.53 16,43.31 15.66,43.65 15.29,43.65 14.49,44.45 v14.48,44.45
N$35  (via drill 0.4)
  Top 0.381: R3.1 v22.35,54.74
  Bottom 0.381: LED1.2 v22.35,54.74
N$36  (via drill 0.4)
  Top 0.292: IC1.36 22.45,49.76 22.99,50.29 v22.99,51.69
  Top 0.381: R16.2 R17.2 46.35,11.53 44.09,13.79 44.09,17.12 v43.94,17.27 42.72,18.49 16.05,18.49 14.1,20.45 6.48,20.45 4.89,22.04 4.89,34.35 5.71,35.18 v5.97,35.18 | C12.2 49.28,8.89 48.64,9.53 48.64,16 47.37,17.27 v45.72,17.27
  Bottom 0.381: v5.97,35.18 6.13,35.02 7.19,35.02 7.66,35.48 7.66,35.71 11.61,39.66 13.32,39.66 14.02,38.96 18.18,38.96 19.7,40.47 19.7,42.59 19.51,42.77 19.51,45.87 21.97,48.34 21.97,49.16 23.02,50.22 23.02,51.65 v22.99,51.69 | v45.72,17.27 v43.94,17.27
N$37
  Top 0.292: IC3.6 27.45,4.71 27.56,4.83 27.56,5.33 26.54,6.35 C17.2
N$38
  Top 0.292: D1.1 22.93,3.26 24.08,3.26 24.23,3.41 IC3.3 | IC3.1 24.23,4.71 24.08,4.87 23.06,4.87 D2.1
  Top 0.381: C13.2 22.72,7.2 D2.1 D1.1 22.72,2.17 23.04,1.85 27.3,1.85 48.84,1.85 49.4,2.41 R13.1
N$39  (via drill 0.4)
  Top 0.292: IC1.41 19.95,50.28 18.92,51.31 v18.92,51.69
  Top 0.381: R20.1 v15.49,4.7 | v15.49,8.51 R21.2 16.51,9.14 15.65,10.01 15.65,16.36 13.31,18.69 5.75,18.69 3.14,21.31 3.14,35.51 4.95,37.32 v4.95,38.23 | v16.13,41.53 16.13,41.42 15.48,40.77 9.38,40.77 8.97,41.18 7.91,41.18 v7.87,41.15
  Bottom 0.381: v15.49,8.51 v15.49,4.7 | v18.92,51.69 19.05,51.56 19.05,49.55 16.59,47.08 16.59,42.1 16.13,41.64 v16.13,41.53 | v7.87,41.15 7.75,41.02 7.75,40.01 6.68,38.94 6.04,38.94 5.33,38.23 v4.95,38.23
N$40
  Top 0.292: IC3.4 28.1,3.41 D3.2
  Top 0.381: D3.2 29.59,3.05 30.17,3.62 C14.2
N$41
  Top 0.381: R18.1 4.83,17.02 4.95,16.89 7.46,16.89 CON4.2
N$42
  Top 0.381: CON4.3 9.02,13.84 9.65,13.21 13.72,13.21 14.48,13.97 14.48,15.88 12.83,17.53 5.21,17.53 4.45,18.29 R19.1
N$43
  Top 0.292: IC1.3 15.39,46.71 15.24,46.86
  Top 0.381: 15.24,46.86 13.15,48.95 2.98,48.95 1.38,47.36 1.38,17.29 1.65,17.02 R18.2
N$44
  Top 0.292: IC1.4 15,46.21 14.48,46.74
  Top 0.381: 14.48,46.74 12.85,48.37 3.22,48.37 1.97,47.12 1.97,19.24 2.29,18.92 R19.2
N$45  (via drill 0.4)
  Top 0.292: IC1.9 16.15,43.71 16,43.56 14.1,43.56 13.69,43.96 13.69,46.68 12.62,47.75 6.6,47.75 v6.35,47.5
  Top 0.381: v6.35,50.67 6.35,53.2 10.69,57.53 CON1.3
  Bottom 0.381: v6.35,50.67 v6.35,47.5
N$46
  Top 0.381: Q4.1 40.33,4.51 R33.1 R32.2
N$47  (via drill 0.4)
  Top 0.292: IC1.37 21.95,50.4 v22.23,50.67
  Top 0.381: R14.1 46.47,3.05 46.82,3.4 46.82,7.08 47.37,7.63 47.37,11.4 44.87,13.91 44.87,17.48 43.27,19.07 16.3,19.07 14.34,21.03 6.72,21.03 5.47,22.28 5.47,33.54 6.86,34.92 v6.86,35.81
  Bottom 0.381: v6.86,35.81 6.94,35.81 11.37,40.24 13.56,40.24 14.26,39.55 17.94,39.55 19.11,40.72 19.11,42.34 18.92,42.53 18.92,46.11 21.39,48.58 21.39,50.09 21.97,50.67 v22.23,50.67
N$49  (via drill 0.4)
  Top 0.292: v19.94,51.69 19.94,51.05 20.45,50.54 IC1.40
  Top 0.381: R22.2 R23.1 15.49,7.24 14.7,8.04 14.7,8.84 15.06,9.2 15.06,16.12 13.07,18.11 5.51,18.11 2.55,21.07 2.55,35.75 4.06,37.26 v4.06,37.59 | v17.14,41.53 17.14,41.42 15.91,40.18 8.84,40.18 v8.64,40.39
  Bottom 0.381: v17.14,41.53 17.17,41.55 17.17,46.84 19.63,49.3 19.63,51.15 19.97,51.49 19.97,51.65 v19.94,51.69 | v8.64,40.39 8.64,40.02 6.95,38.34 6.29,38.34 5.06,37.11 4.55,37.11 v4.06,37.59
N$50  (via drill 0.4)
  Top 0.292: IC1.38 21.45,51.05 21.97,51.56 v21.97,51.69
  Top 0.381: R34.1 39.1,3.05 39.45,3.4 39.45,7.28 40.01,7.83 40.01,9.65 41.07,10.72 41.07,15.29 41.82,16.04 41.82,16.84 41.34,17.32 15.51,17.32 13.55,19.28 6,19.28 3.72,21.55 3.72,35.2 5.51,36.99 6.55,36.99 6.71,36.83 v6.73,36.83
  Bottom 0.381: v6.73,36.83 7.13,36.83 11.12,40.83 13.8,40.83 14.5,40.13 17.7,40.13 18.53,40.96 18.53,42.1 18.34,42.29 18.34,46.36 20.8,48.82 20.8,50.38 21.97,51.55 v21.97,51.69
N$51  (via drill 0.4)
  Top 0.292: IC1.39 v20.95,51.69
  Top 0.381: R32.1 42.78,3.05 43.1,3.36 43.1,7.16 43.43,7.49 43.43,8.13 41.66,9.91 41.66,15.05 42.4,15.79 42.4,17.16 41.66,17.91 15.81,17.91 13.86,19.86 6.24,19.86 4.3,21.8 4.3,34.64 5.84,36.18 v5.84,36.2
  Bottom 0.381: v5.84,36.2 5.84,37.07 6.47,37.7 7.17,37.7 10.88,41.41 14.1,41.41 14.78,40.73 17.48,40.73 17.94,41.2 17.94,41.86 17.75,42.05 17.75,46.6 20.22,49.06 20.22,50.83 20.83,51.44 20.83,51.56 v20.95,51.69
N$53
  Top 0.381: Q2.1 47.69,4.51 R12.2 R13.2
N$55  (via drill 0.4)
  Top 0.508: Q1.3 52.32,3.17 v53.34,2.16
  Bottom 0.508: CON3.1 v53.34,2.16
N$58  (via drill 0.4)
  Top 0.381: R15.1 45.91,4.51 Q3.2 45.91,7.3 v46.35,7.75 | Q2.2 49.59,7.43 v49.91,7.75 | v53.34,4.32 53.27,4.38 Q1.2
  Bottom 0.635: v46.35,7.75 v49.91,7.75 51.56,7.75 53.34,5.97 v53.34,4.32
N$59
  Top 0.381: R16.1 44.83,8.04 Q3.3
N$60  (via drill 0.4)
  Top 0.381: v28.7,59.69 28.7,59.5 27.94,58.74 27.94,56.9 28.4,56.44 28.4,52.36 28.74,52.02 28.74,49.96 27.48,48.71 27.48,40.51 26.92,39.95 26.43,39.95 25.27,38.79 25.27,36.83 24.13,35.69 24.13,33.66 24.89,32.89 25.45,32.89 26.42,33.86 R5.1
  Bottom 0.381: v28.7,59.69 26.92,59.69 CON2.6
N$61
  Top 0.292: IC1.33 24.85,47.71 25.4,48.26 25.4,48.77 25.13,49.03 25.13,51.76 25.78,52.4 R2.2
  Top 0.381: R1.1 R2.2
N$63  (via drill 0.4)
  Top 0.381: MOD1.17 41.02,26.53 R9.1 40.26,24.51 39.75,24 30.23,24 29.72,24.51 v29.72,24.89 | v30.73,50.42 v30.73,52.2
  Bottom 0.381: CON2.10 17.65,58.8 17.65,57.01 18.4,56.26 18.8,56.26 19.43,55.63 26.8,55.63 30.23,52.2 v30.73,52.2 | v30.73,50.42 30.73,30.23 29.72,29.21 v29.72,24.89
N$64  (via drill 0.4)
  Top 0.292: IC1.13 18.95,40.04 18.27,39.36 12.71,39.36 12.7,39.37
  Top 0.381: IC2.2 12.48,36.03 C8.2 R4.2 v12.7,38.48 12.7,39.37 12.47,39.6 8.98,39.6 8.97,39.59 3.21,39.59 2.63,40.17 2.63,46.57 3.56,47.5 v4.19,47.5 | v4.19,50.67 4.45,50.42 4.83,50.42 5.77,51.36 5.77,53.45 8.81,56.5 8.81,57.48 CON1.5 | v28.57,21.72 29.01,22.15 44.31,22.15 47.19,25.03 47.19,35.06 48.97,36.84 48.97,38.57 49.18,38.79 49.18,40.73 46.61,43.31 46.61,49.53 v41.53,54.61 | v9.91,32.38 10.22,32.38 10.93,31.67 17.11,31.67 17.7,31.08 18.62,31.08 19.41,31.88 21.59,31.88 23.5,29.97 v24,29.97
  Bottom 0.381: v4.19,50.67 v4.19,47.5 | SW1.4 SW1.1 41.58,54.66 v41.53,54.61 | v28.57,21.72 28.19,22.1 28.19,29.08 27.3,29.97 v24,29.97 | v12.7,38.48 12.7,37.53 10.12,34.96 10.12,32.6 v9.91,32.38
UVCC  (via drill 0.4)
  Top 0.292: IC1.7 15.88,44.71 v15.62,44.45 | IC1.2 16.16,47.21 v15.88,47.5
  Top 0.381: R20.2 17.98,4.64 F1.2
  Top 0.635: F1.2 D1.2 19.45,2.05 18.92,1.52 12.06,1.52 0.67,12.92 0.67,47.65 2.68,49.66 13.53,49.66 15.69,47.5 v15.88,47.5
  Bottom 0.381: v15.88,47.5 15.88,44.7 v15.62,44.45
VCC  (via drill 0.4)
  Top 0.292: IC1.14 19.45,39.77 18.54,38.86 16.13,38.86 15.37,38.1 C1.2 | v26.67,41.78 26.61,41.78 25.18,43.21 IC1.24 | IC1.34 23.45,49.19 24.64,50.37 24.64,51.18 24.26,51.56 | 17.14,52.45 17.14,51.29 17.26,51.18 17.26,50 17.72,49.54 18.15,49.54 18.45,49.24 IC1.44
  Top 0.381: C15.2 C16.2 26.54,10.67 | D3.1 D4.1 | R4.1 C1.2 C2.2 15.37,33.15 | IC2.1 9.46,34.73 C7.2 9.65,33.78 11.18,32.26 15.11,32.26 15.37,32.51 15.37,33.15 | CON1.2 15.11,58.8 16.38,58.8 | 16.38,58.8 CON2.5 16.38,54.67 17.14,53.91 17.14,52.49 | 17.14,52.45 17.14,52.49 | v31.75,7.87 31.73,7.89 31.73,8.89 | v26.67,32.13 26.67,28.45 v26.54,28.32 | 23.3,52.49 23.33,52.49 24.26,51.56 | 23.3,52.49 20.83,52.49 | 20.83,52.49 17.14,52.49 | R1.2 23.62,54.74 23.3,54.42 23.3,52.49 | R3.2 20.83,52.49 | CON2.3 20.19,58.8 16.38,58.8 | R35.2 38.54,4.51 Q5.2 38.54,7.55 v38.86,7.87 | R33.2 42.23,4.51 Q4.2 42.23,7.55 v42.55,7.87 | v16,33.02 15.49,33.02 15.37,33.15 | 18.94,30.3 19.68,29.56 R24.1 R29.1 20.57,27.18 21.5,26.25 21.5,25.56 20.57,24.64 R26.1 R28.1 R25.1
  Top 0.635: v48.26,8.76 48.39,8.76 48.64,8.51 Q2.3
  Top 0.762: v6.35,32.13 8.76,32.13 10.08,30.81 15.95,30.81 v16,30.86 16.83,30.86 17.38,30.3 18.94,30.3 19.74,31.1 21.27,31.1 21.97,30.4 21.97,30.1 v24,28.07
  Top 0.889: D4.1 31.73,8.89 31.73,9.54 30.61,10.67 26.54,10.67 18.92,10.67 v16.64,12.95 | v7.24,52.83 7.24,52.07 8.68,50.63 13.54,50.63 14.99,52.07 v14.99,52.96
  Bottom 0.381: v26.67,32.13 26.67,32.46 26.11,33.02 25.04,33.02 24.48,33.58 24.48,34.26 24.49,34.26 24.94,34.71 27.09,34.71 27.52,35.14 27.52,40.93 v26.67,41.78
  Bottom 0.635: v48.26,8.76 45.97,8.76 45.09,7.87 v42.55,7.87 v38.86,7.87 38.32,7.87 37.7,8.49 32.37,8.49 v31.75,7.87 | v16,33.02 v16,30.86
  Bottom 0.762: v26.54,28.32 26.29,28.07 v24,28.07 | v6.35,32.13 1.52,32.13
  Bottom 0.889: v16.64,12.95 14.99,14.61 14.99,16.38 1.52,29.84 1.52,32.13 1.52,50.93 3.43,52.83 v7.24,52.83 | v14.99,52.96 15.88,53.85 15.88,55.88 16.38,56.39 CON2.5
VEXT  (via drill 0.4)
  Top 0.381: R22.1 18.29,6.22 19.45,6.22
  Top 0.889: D2.2 19.45,6.22 19.45,7.1 v19.43,7.11 | v21.08,1.52 21.59,1.02 53.85,1.02 54.39,1.56 54.39,6.88 53.98,7.3 53.98,8.64 53.25,9.36 53.25,10.47 52.63,11.08 50.48,11.08 CON6.3
  Bottom 0.889: v19.43,7.11 21.08,5.46 v21.08,1.52
(copper drawn outside any net)
  shapes: Bottom area x2

### Text on the board
bNames: CON6 | DOUT | GND | VIN